# EAGLE design E300 (EAGLE 9.4.1)
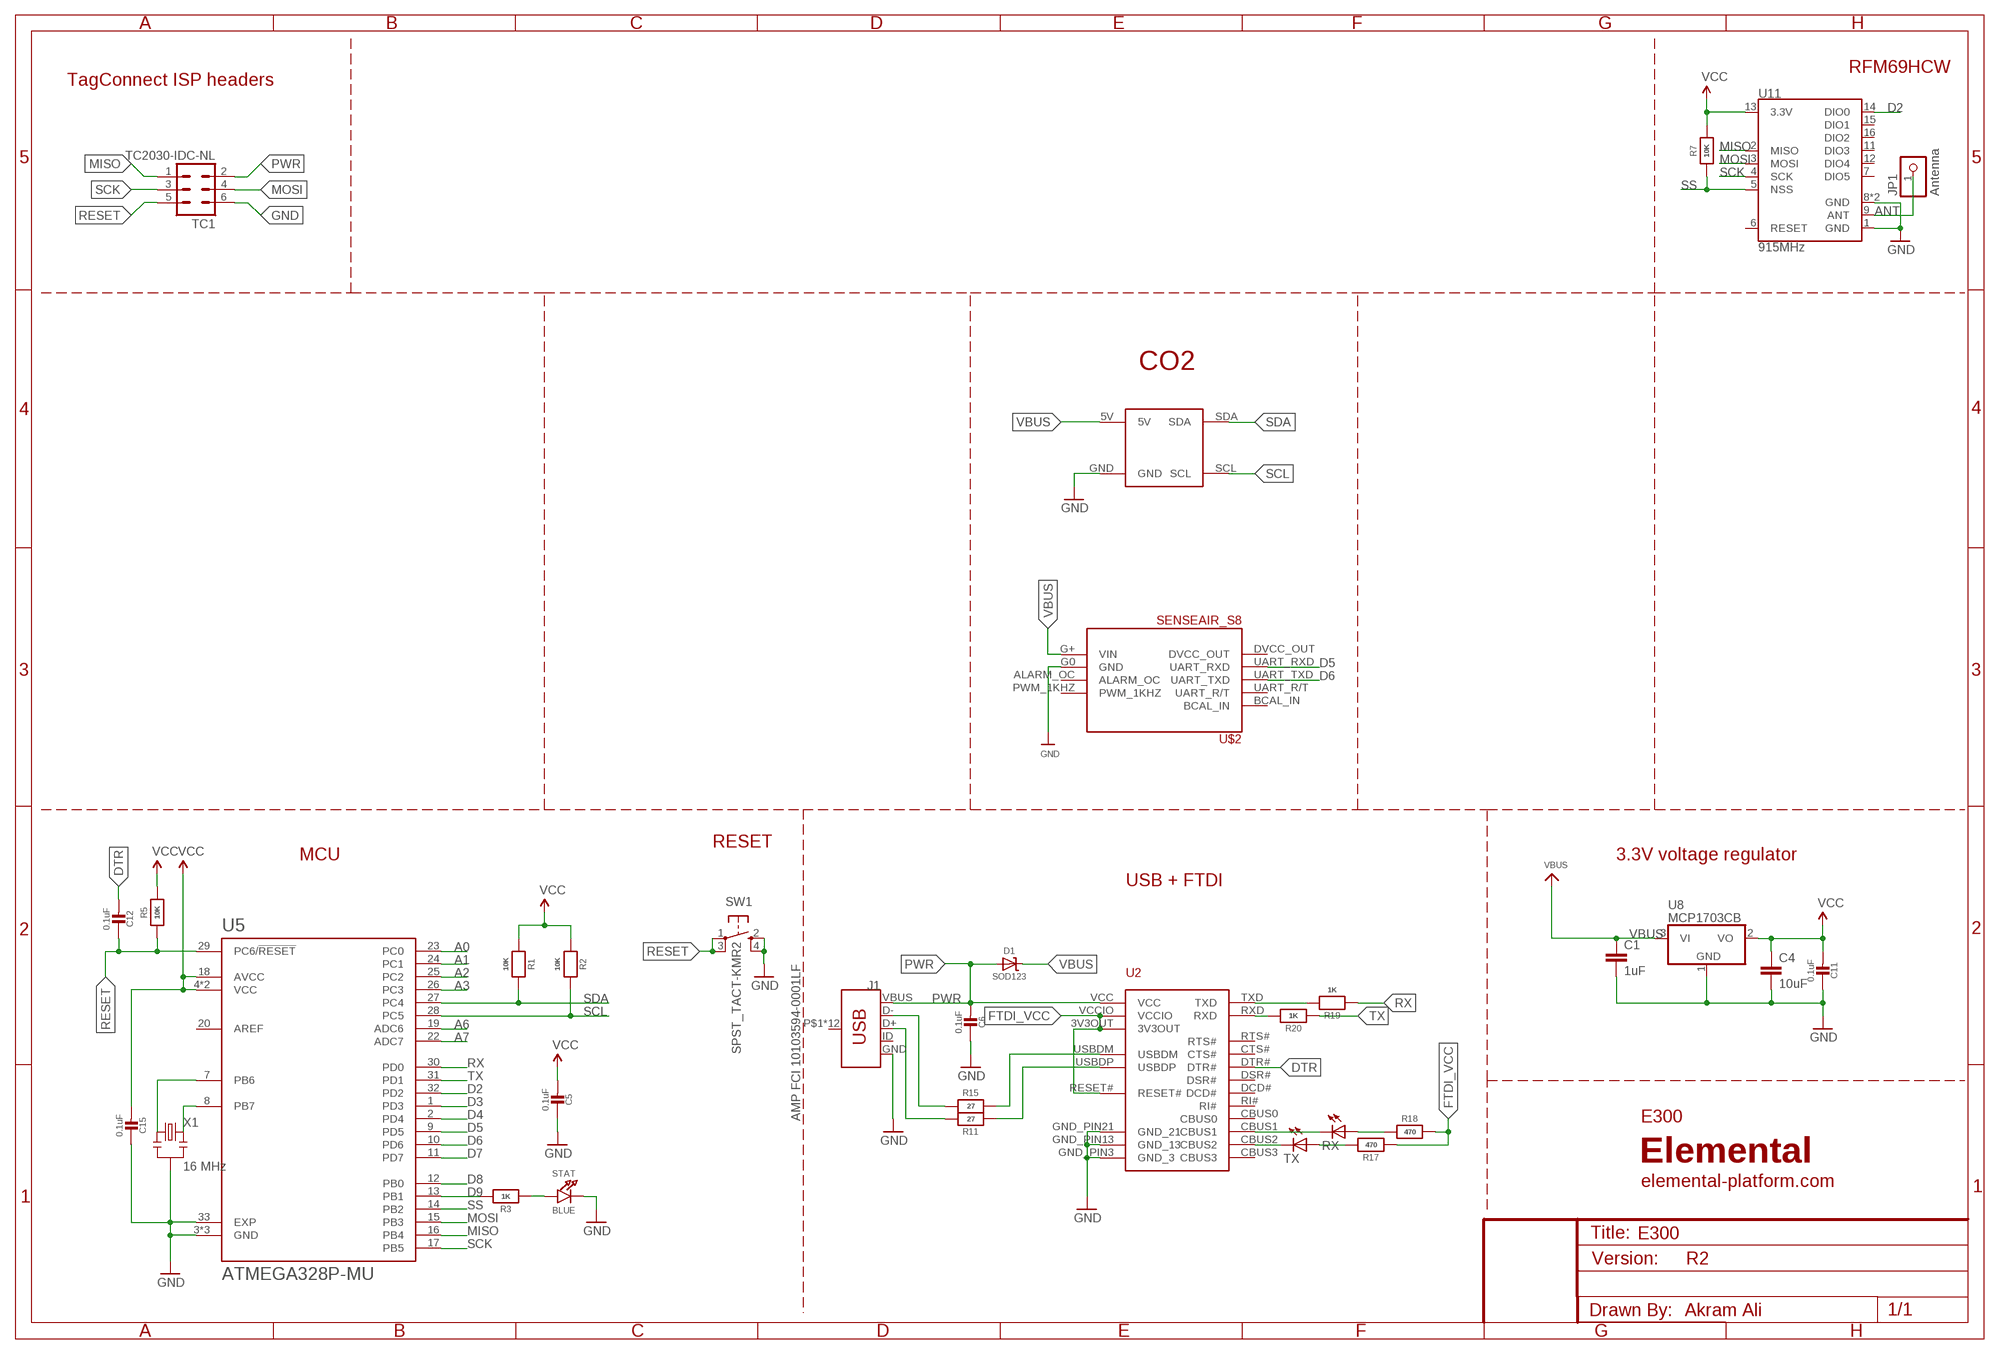
[diagram p0: schematic, sheet 1]

## Parts
C1  1uF  CAP0805  [0805]
C4  10uF  CAP0805  [0805]
C5  0.1uF  MICROBUILDER_CAP_CERAMIC_0402MP  [MICROBUILDER__0402MP]
C6  0.1uF  MICROBUILDER_CAP_CERAMIC_0402MP  [MICROBUILDER__0402MP]
C11  0.1uF  MICROBUILDER_CAP_CERAMIC_0402MP  [MICROBUILDER__0402MP]
C12  0.1uF  MICROBUILDER_CAP_CERAMIC_0402MP  [MICROBUILDER__0402MP]
C15  0.1uF  MICROBUILDER_CAP_CERAMIC_0402MP  [MICROBUILDER__0402MP]
D1  SOD123  MICROBUILDER_DIODE-SCHOTTKYSOD-123  [MICROBUILDER_SOD-123]
J1  AMP FCI 10103594-0001LF  USB_MICRO-B_HALF_PTH  [USB-MICROB-PTH]
JP1  Antenna  PINHD-1X1CB  [1X01-CLEANBIG]
R1  10K  MICROBUILDER_RESISTOR_0402MP  [MICROBUILDER__0402MP]
R2  10K  MICROBUILDER_RESISTOR_0402MP  [MICROBUILDER__0402MP]
R3  1K  MICROBUILDER_RESISTOR_0402MP  [MICROBUILDER__0402MP]
R5  10K  MICROBUILDER_RESISTOR_0402MP  [MICROBUILDER__0402MP]
R7  10K  MICROBUILDER_RESISTOR_0402MP  [MICROBUILDER__0402MP]
R11  27  MICROBUILDER_RESISTOR_0402MP  [MICROBUILDER__0402MP]
R15  27  MICROBUILDER_RESISTOR_0402MP  [MICROBUILDER__0402MP]
R17  470  MICROBUILDER_RESISTOR_0402MP  [MICROBUILDER__0402MP]
R18  470  MICROBUILDER_RESISTOR_0402MP  [MICROBUILDER__0402MP]
R19  1K  MICROBUILDER_RESISTOR_0402MP  [MICROBUILDER__0402MP]
R20  1K  MICROBUILDER_RESISTOR_0402MP  [MICROBUILDER__0402MP]
RX  LEDCHIPLED_0805  [CHIPLED_0805]
STAT  BLUE  LED0805_NOOUTLINE  [CHIPLED_0805_NOOUTLINE]
SW1  SPST_TACT-KMR2  [KMR2]
TC1  TC2030-IDC-NL  [TC2030-IDC-NL]
TX  LEDCHIPLED_0805  [CHIPLED_0805]
U2  FT231XQ-R  [FTDI_FT231XQ-R_PACKAGE]
U5  ATMEGA328P-MU  [QFN50P500X500X100-33N]
U6  K30-CO2-I2C  [K30-CO2-I2C]
U8  MCP1703CB  [SOT23]
U11  915MHz  RFM69HCW-915  [RFM69HCW-XXXS2]
U$2  SENSEAIR_S8  [SENSEAIR_S8]
X1  16 MHz  RESONATORSMD  [RESONATOR-SMD]

## Nets
A0: U5.23(PC0)
A1: U5.24(PC1)
A2: U5.25(PC2)
A3: U5.26(PC3)
A6: U5.19(ADC6)
A7: U5.22(ADC7)
ANT: JP1.1 U11.9(ANT)
D2: U5.32(PD2) U11.14(DIO0)
D3: U5.1(PD3)
D4: U5.2(PD4)
D5: U5.9(PD5) U$2.UART_RXD
D6: U5.10(PD6) U$2.UART_TXD
D7: U5.11(PD7)
D8: U5.12(PB0)
D9: R3.2 U5.13(PB1)
DTR: C12.2 U2.DTR#
FTDI_VCC: R17.1 R18.2 U2.3V3OUT U2.RESET# U2.VCCIO
GND: C1.2 C4.2 C5.1 C6.1 C11.1 C15.1 J1.GND STAT.C SW1.2(S) SW1.4(S1) TC1.6 U2.GND_PIN3(GND_3) U2.GND_PIN13(GND_13) U2.GND_PIN21(GND_21) U5.3(GND) U5.5(GND) U5.21(GND) U5.33(EXP) U6.GND U8.1(GND) U11.1(GND) U11.8(GND) U11.10(GND) U$2.G0(GND) X1.2
MISO: TC1.1 U5.16(PB4) U11.2(MISO)
MOSI: TC1.4 U5.15(PB3) U11.3(MOSI)
N$2: R20.2 U2.RXD
N$3: R19.2 U2.TXD
N$4: U5.8(PB7) X1.3
N$5: U5.7(PB6) X1.1
N$8: R3.1 STAT.A
N$17: RX.C U2.CBUS1
N$18: TX.C U2.CBUS2
N$25: R15.2 U2.USBDM
N$26: R11.1 U2.USBDP
N$27: R18.1 RX.A
N$29: R17.2 TX.A
N$32: J1.D- R15.1
N$33: J1.D+ R11.2
PWR: C6.2 D1.A J1.VBUS TC1.2 U2.VCC
RESET: C12.1 R5.1 SW1.1(P) SW1.3(P1) TC1.5 U5.29(PC6/!RESET)
RX: R19.1 U5.30(PD0)
SCK: TC1.3 U5.17(PB5) U11.4(SCK)
SCL: R2.2 U5.28(PC5) U6.SCL
SDA: R1.2 U5.27(PC4) U6.SDA
SS: R7.1 U5.14(PB2) U11.5(NSS)
TX: R20.1 U5.31(PD1)
VBUS: C1.1 D1.C U6.5V U8.3(VI) U$2.G+(VIN)
VCC: C4.1 C5.2 C11.2 C15.2 R1.1 R2.1 R5.2 R7.2 U5.4(VCC) U5.6(VCC) U5.18(AVCC) U8.2(VO) U11.13(3.3V)
Unconnected: J1.ID J1.P$1(SHIELD) J1.P$2(SHIELD) J1.P$3(SHIELD) J1.P$4(SHIELD) J1.P$6(SHIELD) J1.P$8(SHIELD) J1.P$10(SHIELD) J1.P$12(SHIELD) J1.SHEILD2(SHIELD) J1.SHIELD J1.SHIELD3(SHIELD) J1.SHIELD4(SHIELD) U2.CBUS0 U2.CBUS3 U2.CTS# U2.DCD# U2.DSR# U2.RI# U2.RTS# U5.20(AREF) U11.6(RESET) U11.7(DIO5) U11.11(DIO3) U11.12(DIO4) U11.15(DIO1) U11.16(DIO2) U$2.ALARM_OC U$2.BCAL_IN U$2.DVCC_OUT U$2.PWM_1KHZ U$2.UART_R/T

## Notes on the sheet
- RFM69HCW
- TagConnect ISP headers
- CO2
- RESET
- MCU | 3.3V voltage regulator
- USB + FTDI
- E300
- Elemental
- elemental-platform.com
- R2
- Akram Ali

## Library data of the parts
C1 = SparkFun-Capacitors:CAP: Capacitor Standard 0603 ceramic capacitor, and 0.1" leaded capacitor.; MPN: CC0805ZRY5V8BB105
C4 = SparkFun-Capacitors:CAP: Capacitor Standard 0603 ceramic capacitor, and 0.1" leaded capacitor.; MPN: CC0805KKX5R6BB106
C5 C6 C11 C12 C15 = Adafruit Feather 32u4 Bluefruit LE:MICROBUILDER_CAP_CERAMIC: Ceramic Capacitors For new designs, use the packages preceded by an '_' character since they are more reliable: The following footprints should be used on most boards: _0402 - Standard footprint for regular board layouts _0603 - Standard footprint for regular board layouts _0805 - Standard footprint for regular board layouts _1206 - Standard footprint for regular board layouts For extremely tight-pitch boards where space is at a premium, the following 'micro-pitch' footprints can be used (smaller pads, no silkscreen outline, etc.): _0402MP - Micro-pitch footprint for very dense/compact boards _0603MP - Micro-pitch footprint for very dense/compact boards _0805MP - Micro-pitch footprint for very dense/compact boards _1206MP - Micro-pitch footprint for very dense/compact boards; MPN: GRM155R71C104KA88J
D1 = Adafruit Feather 32u4 Bluefruit LE:MICROBUILDER_DIODE-SCHOTTKY; MPN: SD103AW-13-F
J1 = SparkFun-Connectors:USB_MICRO-B: USB Type Micro-B Connector Male/female and PTH/SMT variants SparkFun Products: SparkFun microB USB Breakout <https://www.sparkfun.com/products/12035> SparkFun USB microB Plug Breakout <https://www.sparkfun.com/products/10031> SparkFun ESP8266 Thing <https://www.sparkfun.com/products/13231>; PROD_ID: CONN-13711
JP1 = adafruit@1:PINHD-1X1: Pin header 1x1 for 0.1" spacing With round pins; MPN: Helical antenna
R1 R2 R19 R20 = Adafruit Feather 32u4 Bluefruit LE:MICROBUILDER_RESISTOR: Resistors For new designs, use the packages preceded by an '_' character since they are more reliable: The following footprints should be used on most boards: _0402 - Standard footprint for regular board layouts _0603 - Standard footprint for regular board layouts _0805 - Standard footprint for regular board layouts _1206 - Standard footprint for regular board layouts For extremely tight-pitch boards where space is at a premium, the following 'micro-pitch' footprints can be used (smaller pads, no silkscreen outline, etc.): _0402MP - Micro-pitch footprint for very dense/compact boards _0603MP - Micro-pitch footprint for very dense/compact boards _0805MP - Micro-pitch footprint for very dense/compact boards _1206MP - Micro-pitch footprint for very dense/compact boards; MPN: RC0402JR-071KL
R3 R5 R7 = Adafruit Feather 32u4 Bluefruit LE:MICROBUILDER_RESISTOR: Resistors For new designs, use the packages preceded by an '_' character since they are more reliable: The following footprints should be used on most boards: _0402 - Standard footprint for regular board layouts _0603 - Standard footprint for regular board layouts _0805 - Standard footprint for regular board layouts _1206 - Standard footprint for regular board layouts For extremely tight-pitch boards where space is at a premium, the following 'micro-pitch' footprints can be used (smaller pads, no silkscreen outline, etc.): _0402MP - Micro-pitch footprint for very dense/compact boards _0603MP - Micro-pitch footprint for very dense/compact boards _0805MP - Micro-pitch footprint for very dense/compact boards _1206MP - Micro-pitch footprint for very dense/compact boards; MPN: RC0402JR-0710KL
R11 R15 = Adafruit Feather 32u4 Bluefruit LE:MICROBUILDER_RESISTOR: Resistors For new designs, use the packages preceded by an '_' character since they are more reliable: The following footprints should be used on most boards: _0402 - Standard footprint for regular board layouts _0603 - Standard footprint for regular board layouts _0805 - Standard footprint for regular board layouts _1206 - Standard footprint for regular board layouts For extremely tight-pitch boards where space is at a premium, the following 'micro-pitch' footprints can be used (smaller pads, no silkscreen outline, etc.): _0402MP - Micro-pitch footprint for very dense/compact boards _0603MP - Micro-pitch footprint for very dense/compact boards _0805MP - Micro-pitch footprint for very dense/compact boards _1206MP - Micro-pitch footprint for very dense/compact boards; MPN: RC0402JR-0727RL
R17 R18 = Adafruit Feather 32u4 Bluefruit LE:MICROBUILDER_RESISTOR: Resistors For new designs, use the packages preceded by an '_' character since they are more reliable: The following footprints should be used on most boards: _0402 - Standard footprint for regular board layouts _0603 - Standard footprint for regular board layouts _0805 - Standard footprint for regular board layouts _1206 - Standard footprint for regular board layouts For extremely tight-pitch boards where space is at a premium, the following 'micro-pitch' footprints can be used (smaller pads, no silkscreen outline, etc.): _0402MP - Micro-pitch footprint for very dense/compact boards _0603MP - Micro-pitch footprint for very dense/compact boards _0805MP - Micro-pitch footprint for very dense/compact boards _1206MP - Micro-pitch footprint for very dense/compact boards; MPN: RC0402JR-07470RL
RX TX = adafruit:LED: LED; MPN: LG R971-KN-1; OC_NEWARK: unknown
STAT = microbuilder:LED: LED
SW1 = adafruit:SPST_TACT: SMT 6mm switch, EVQQ2 series http://www.ladyada.net/library/eagle
TC1 = TagConnect:TC2030-IDC: Tag-Connect In Circuit Programming & Debug Cable 6 Pin http://www.tag-connect.com
U2 = ftdi_ft231xq-r:FT231XQ-R: This is the 20-LD QFN package of the FTDI FT231XQ-R chip.; MPN: FT231XQ-R
U5 = ATMEGA328P-MU:ATMEGA328P-MU: ATmega Series 20 MHz 32 KB Flash 2 KB SRAM 8-Bit Microcontroller - QFN-32; AVAILABILITY: Good; DESCRIPTION: ATmega Series 20 MHz 32 KB Flash 2 KB SRAM 8-Bit Microcontroller - QFN-32; MF: Atmel; MP: ATMEGA328P-MU; MPN: ATMEGA328P-MU; PACKAGE: QFN-32 Atmel; PRICE: 2.55 USD
U6 = K30-CO2-I2C:K30-CO2-I2C: K-30 CO2 sensor I2C connection Designed by AKstudios
U8 = linear:MCP1703: 250 mA, 16V, Low Quiescent Current LDO Regulator Source: http://ww1.microchip.com/downloads/en/DeviceDoc/22049b.pdf; MPN: MCP1703T-3302E/CB; OC_NEWARK: 18T9177
U11 = SparkFun-RF:RFM69H: Hope RF RFM69H ISM Transceiver Module The RFM69H is a transceiver module capable of operation over a wide frequency range, including the 315,433,868 and 915MHz license-free ISM (Industry Scientific and Medical) frequency bands. All major RF communication parameters are programmable and most of them can be dynamically set. The RFM69H offers the unique advantage of programmable narrow-band and wide- band communication modes. The RFM69H is optimized for low power consumption while offering high RF output power and channelized operation.Compliance ETSI and FCC regulations. Datasheet <http://www.hoperf.cn/upload/docs/RF/SX/RFM69H_DataSheet_v1.3.pdf> SparkFun Products RFM69HCW Wireless Transceiver - 915MHz <https://www.sparkfun.com/products/13909> (COM-13909) RFM69HCW Wireless Transceiver - 434MHz <https://www.sparkfun.com/products/13910> (COM-13910) SparkFun RFM69 Breakout (915MHz) <https://www.sparkfun.com/products/12775> (WRL-12775) SparkFun RFM69 Breakout (434MHz) <https://www.sparkfun.com/products/12823> (WRL-12823); MPN: RFM69HCW; PROD_ID: IC-11997
U$2 = SenseAir S8:SENSEAIR_S8: MH-z19 Footprint EAGLE footprint of MH-z19 CO2 sensor. Designed by AKstudios github.com/akstudios
X1 = SparkFun:RESONATOR: Resonator Small SMD resonator. This is the itty bitty 10/20MHz resonators with built in caps. CSTCE10M0G55 and CSTCE20M0V53. Footprint has been reviewed closely but hasn't been tested yet.; MPN: CSTCE16M0V53-R0

## Net classes
1 power: width 0.381 mm, clearance 0.254 mm

## Board
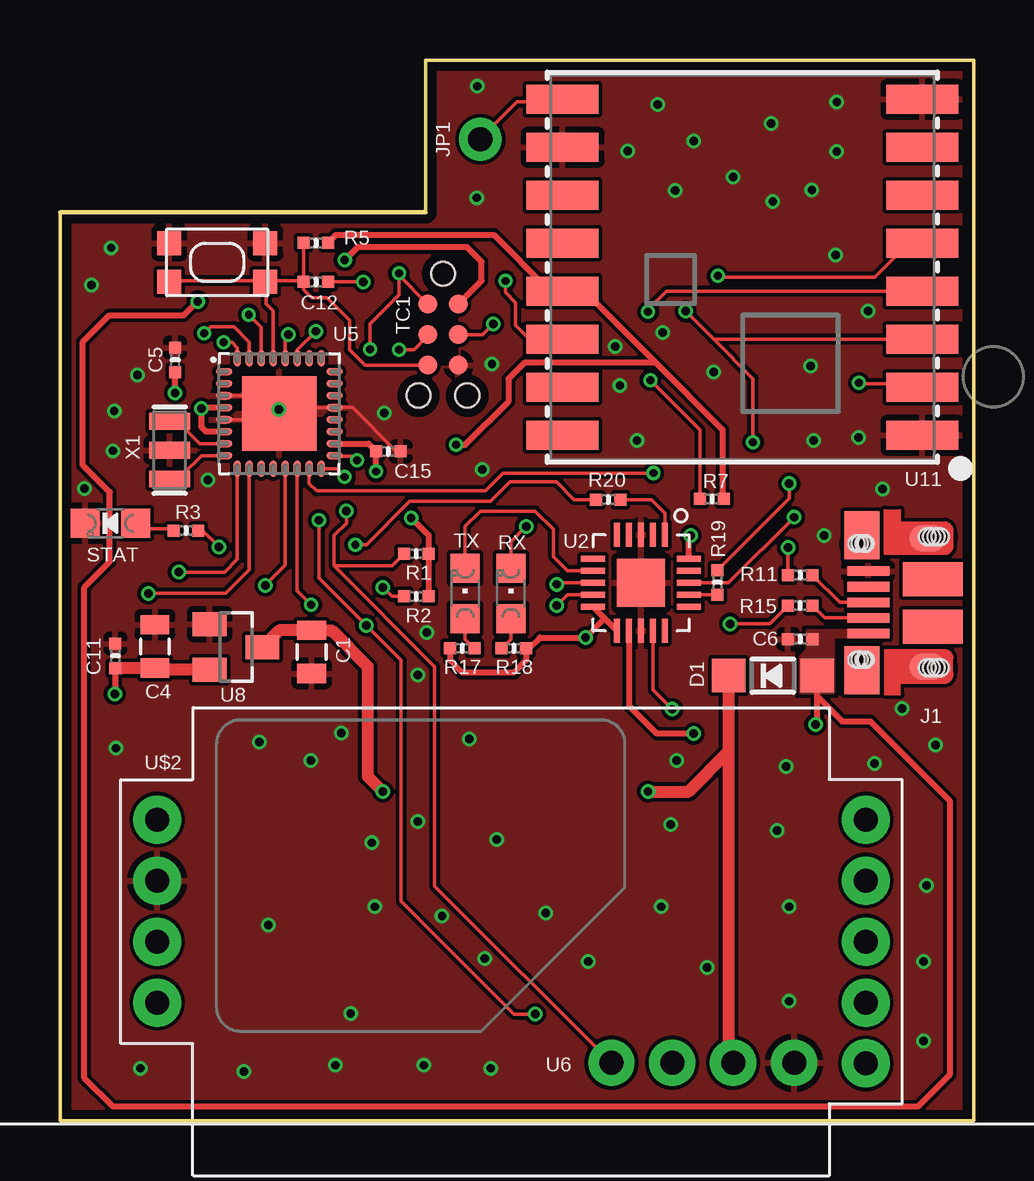
[diagram p1: board, top side]
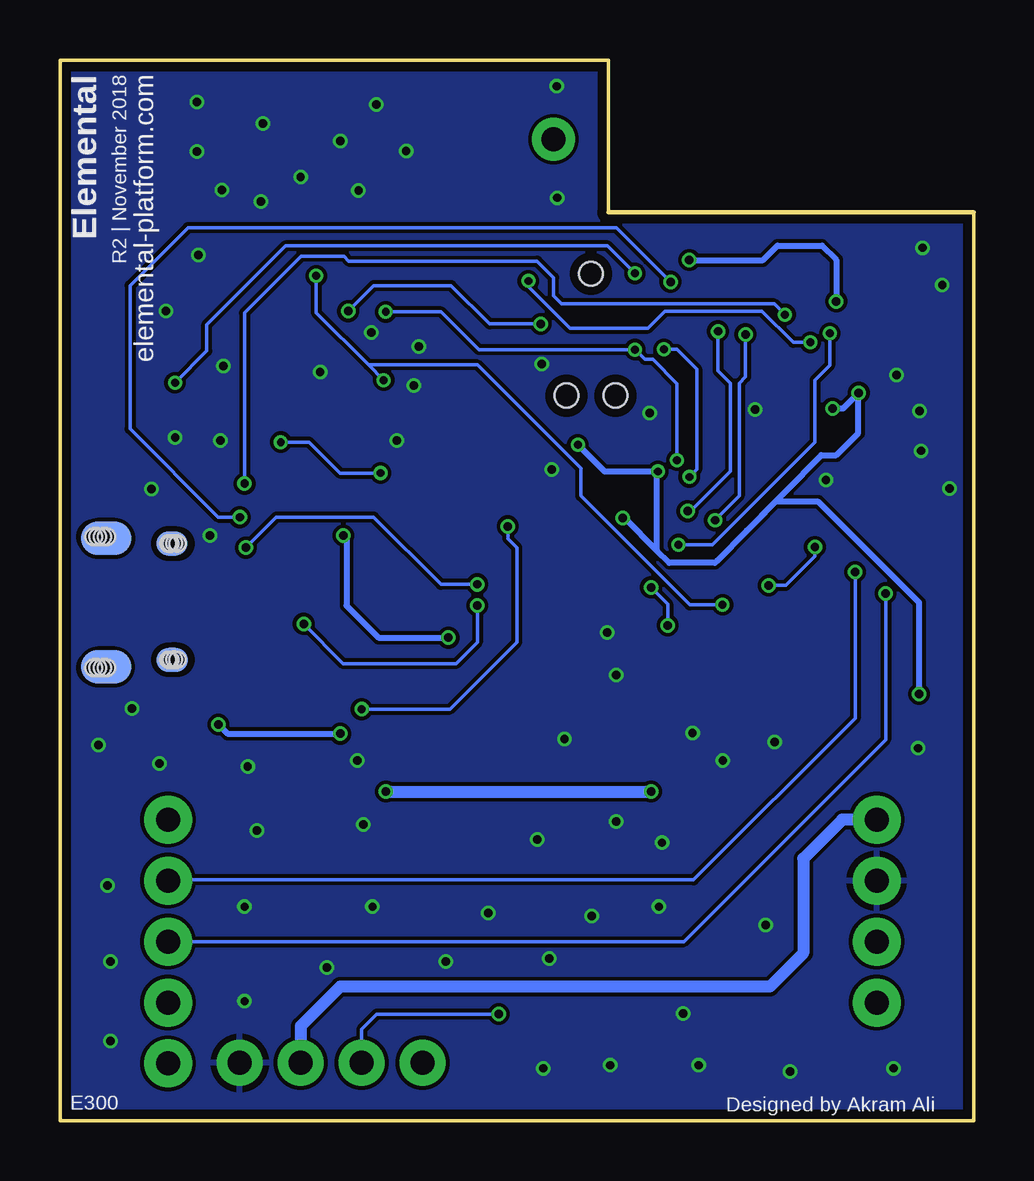
[diagram p2: board, bottom side, seen from below]

Size 38.1 x 44.2 mm. Coordinates in mm from the lower left corner, seen from the top.
Outline: 0,37.85 15.24,37.85 15.24,44.2 38.1,44.2 38.1,0 0,0 0,37.85
Copper layers (1*16): Top 0.035559375mm / dielectric 1.6mm / Bottom 0.035559375mm
Design rules "oshpark-2layer": minimum track width 6mil, minimum drill 10mil, track to track 6mil, track to pad 6mil, pad to pad 6mil, via to via 6mil, smd to smd 6mil, copper to edge 15mil, drill to drill 6mil, minimum pad ring 5mil, minimum via ring 5mil, stop-mask expansion 2.5mil, vias tented up to drill 0mil, thermal gap 10mil

### Footprints (pad centres in the part's own frame; a part is rotated, then mirrored left to right if it is on the bottom)
0805 = smd 0.8 x 1.2: 1 -0.9,0; 2 0.9,0
MICROBUILDER__0402MP = smd 0.5 x 0.5: 1 -0.508,0; 2 0.508,0
MICROBUILDER_SOD-123 = smd 1.4 x 1.4: A 1.85,0; C -1.85,0
USB-MICROB-PTH = smd 0.4 x 1.75: D+ 0.031,1.331; D- -0.619,1.331; GND 1.331,1.331; ID 0.681,1.331; VBUS -1.269,1.331 | smd 1.4 x 2.1 bottom: P$1 2.701,-1.142; P$3 -2.659,-1.144 | smd 1 x 1.3: P$2 2.487,1.594; P$6 -2.368,1.604 | smd 1 x 1.3 bottom: P$4 -2.368,1.604; P$10 2.481,1.598 | smd 1.1 x 1.5: P$8 2.701,-1.142; P$12 -2.659,-1.144 | smd 2 x 1.46: SHEILD2 2.831,1.606; SHIELD -2.794,1.606 | smd 1.425 x 2.5: SHIELD3 -0.979,-1.349; SHIELD4 0.996,-1.352 | hole 0.7: -2.693,-1.134; -2.693,-1.3; -2.694,-1.499; -2.694,-1.664; 2.768,-1.134; 2.767,-1.303; 2.766,-1.496; 2.766,-1.664 | hole 0.66: -2.359,1.821; -2.349,1.691; -2.359,1.541; -2.354,1.432; 2.481,1.821; 2.491,1.691; 2.481,1.541; 2.486,1.432
1X01-CLEANBIG = drill 1.016 pad 1.778: 1 0,0
CHIPLED_0805 = smd 1.2 x 1.2: A 0,-1.05; C 0,1.05
CHIPLED_0805_NOOUTLINE = smd 1.2 x 1.2: A 0,-1.05; C 0,1.05
KMR2 = smd 1 x 1: 1 2,0.8; 2 2,-0.8; 3 -2,0.8; 4 -2,-0.8
TC2030-IDC-NL = smd 0.787 x 0.787: 1 -1.27,-0.635; 2 -1.27,0.635; 3 0,-0.635; 4 0,0.635; 5 1.27,-0.635; 6 1.27,0.635 | hole 0.991: -2.54,0; 2.54,1.016; 2.54,-1.016
FTDI_FT231XQ-R_PACKAGE = smd 0.25 x 1: 3V3OUT 0.968,-2.032; CBUS2 -0.532,-2.032; CBUS3 0.968,1.968; CTS# -1.032,-2.032; DTR# -0.032,1.968; RTS# -0.532,1.968; TXD 0.468,1.968; USBDM 0.468,-2.032; USBDP -0.032,-2.032; VCCIO -1.032,1.968 | smd 1 x 0.25: CBUS0 1.968,0.968; CBUS1 1.968,0.468; DCD# -2.032,-1.032; DSR# -2.032,-0.532; GND_PIN3 -2.032,-0.032; GND_PIN13 1.968,-0.032; RESET# 1.968,-1.032; RI# -2.032,0.468; RXD -2.032,0.968; VCC 1.968,-0.532 | smd 2 x 2: GND_PIN21 -0.032,-0.032
QFN50P500X500X100-33N = smd 0.7 x 0.3: 1 -2.3,1.75; 2 -2.3,1.25; 3 -2.3,0.75; 4 -2.3,0.25; 5 -2.3,-0.25; 6 -2.3,-0.75; 7 -2.3,-1.25; 8 -2.3,-1.75; 17 2.3,-1.75; 18 2.3,-1.25; 19 2.3,-0.75; 20 2.3,-0.25; 21 2.3,0.25; 22 2.3,0.75; 23 2.3,1.25; 24 2.3,1.75 | smd 0.3 x 0.7: 9 -1.75,-2.3; 10 -1.25,-2.3; 11 -0.75,-2.3; 12 -0.25,-2.3; 13 0.25,-2.3; 14 0.75,-2.3; 15 1.25,-2.3; 16 1.75,-2.3; 25 1.75,2.3; 26 1.25,2.3; 27 0.75,2.3; 28 0.25,2.3; 29 -0.25,2.3; 30 -0.75,2.3; 31 -1.25,2.3; 32 -1.75,2.3 | smd 3.1 x 3.1: 33 0,0
K30-CO2-I2C = drill 1 pad 1.93: 5V 43.18,2.54; GND 45.72,2.54; SCL 40.64,2.54; SDA 38.1,2.54
SOT23 = smd 1 x 1.4: 1 -0.95,-1.1; 2 0.95,-1.1; 3 0,1.1
RFM69HCW-XXXS2 = smd 3 x 1.2: 1 -7.5,7; 2 -7.5,5; 3 -7.5,3; 4 -7.5,1; 5 -7.5,-1; 6 -7.5,-3; 7 -7.5,-5; 8 -7.5,-7; 9 7.5,-7; 10 7.5,-5; 11 7.5,-3; 12 7.5,-1; 13 7.5,1; 14 7.5,3; 15 7.5,5; 16 7.5,7
SENSEAIR_S8 = drill 1 pad 2: ALARM_OC 1.515,9.75; BCAL_IN 31.055,4.67; DVCC_OUT 31.055,14.83; G0 1.515,12.29; G+ 1.515,14.83; PWM_1KHZ 1.515,7.21; UART_R/T 31.055,7.21; UART_RXD 31.055,12.29; UART_TXD 31.055,9.75
RESONATOR-SMD = smd 0.7 x 1.7: 1 -1.2,0; 2 0,0; 3 1.2,0

### Placement (x,y rotation side)
C1  10.49,19.53 270 top
C4  3.96,19.76 90 top
C5  4.8,31.7 270 top
C6  30.86,20.07 0 top
C11  2.31,19.37 270 top
C12  10.67,34.95 0 top
C15  13.69,27.89 180 top
D1  29.72,18.54 0 top
J1  35.03,21.56 90 top
JP1  17.53,40.89 0 top
R1  14.86,23.62 180 top
R2  14.86,21.84 180 top
R3  5.26,24.59 0 top
R5  10.67,36.58 0 top
R7  27.18,25.91 0 top
R11  30.86,22.73 0 top
R15  30.86,21.46 180 top
R17  16.76,19.69 0 top
R18  18.92,19.69 0 top
R19  27.41,22.43 270 top
R20  22.86,25.88 0 top
RX  18.8,21.97 0 top
STAT  2.11,24.89 90 top
SW1  6.55,35.76 180 top
TC1  15.96,32.75 270 top
TX  16.89,21.97 0 top
U2  24.26,22.38 270 top
U5  9.14,29.46 0 top
U6  -15.11,-0.13 0 top
U8  7.34,19.74 270 top
U11  28.45,35.56 180 top
U$2  2.54,-2.29 0 top
X1  4.57,27.94 270 top

### Tracks (layer width: path | path; a pad name or v marks a point on that pad's centre or on a via)
ANT
  Top 0.152: U11.9 20.8,42.45 19.05,42.45 17.62,41.02 JP1.1
D2  (via drill 0.33)
  Top 0.152: v18.57,34.99 18.57,34.51 19,34.09 19,33.15 19.54,32.61 20.8,32.61 U11.14 | U5.32 7.39,32.21 7.17,32.43 v6.82,32.43
  Bottom 0.152: v18.57,34.99 18.57,34.75 16.84,33.02 13.59,33.02 12.88,33.73 8.84,33.73 7.54,32.43 v6.82,32.43
D5  (via drill 0.35)
  Top 0.152: v4.95,22.86 6.86,22.86 7.39,23.4 U5.9
  Bottom 0.152: v4.95,22.86 4.95,16.76 11.68,10.03 33.57,10.03 U$2.UART_RXD
D6  (via drill 0.35)
  Top 0.152: U5.10 7.89,22.96 6.91,21.97 v3.68,21.97
  Bottom 0.152: U$2.UART_TXD 12.09,7.46 3.68,15.88 v3.68,21.97
D9  (via drill 0.35)
  Top 0.152: R3.2 5.87,24.67 v6.63,23.91 v6.63,23.9 | v8.56,22.3 9.39,23.14 U5.13
  Bottom 0.152: v8.56,22.3 7.85,22.3 6.63,23.52 v6.63,23.9
DTR  (via drill 0.35)
  Top 0.152: v12.65,34.95 C12.2 | U2.DTR# 27.87,22.41 v30.61,25.15
  Bottom 0.152: v12.65,34.95 14.91,37.21 32.77,37.21 35.18,34.8 35.18,28.83 31.5,25.15 v30.61,25.15
FTDI_VCC  (via drill 0.35)
  Top 0.254: R17.1 16.26,19.18 16.76,18.67 18.92,18.67 19.43,19.18 R18.2 19.56,19.69 20,20.13 v21.91,20.13 22.71,20.93 | U2.3V3OUT 22.71,20.93 | 22.71,20.93 U2.RESET# | U2.VCCIO 26.23,24.32 v26.29,24.38
  Bottom 0.254: v26.29,24.38 26.16,24.26 26.16,21.46 24.83,20.13 v21.91,20.13
GND  (via drill 0.35)
  Top 0.152: U5.5 8.69,29.21 v9.12,29.64 8.55,30.21 U5.3 | C15.1 14.02,27.89 12.19,29.72 U5.21 9.39,29.71 U5.33
  other vias: 2.21,27.91 18.01,31.52 24.92,42.34 26.42,40.82 31.34,38.79 28.07,39.32 17.4,43.1 17.37,38.46 34.29,26.31 33.3,28.47 31.85,24.38 6.17,26.7 2.13,36.37 2.26,29.57 1.02,26.34 17.6,27.13 23.34,30.63 27.25,31.19 33.68,33.73 32.33,36.07 25.65,38.76 32.38,42.44 23.67,40.41 3.23,31.06 32.38,40.39 31.29,31.45 23.14,32.26 25.12,32.84 25.45,12.34 8.69,8.15 26.97,6.38 30.4,4.98 25.07,8.92 13.13,8.92 13,11.58 10.46,15.01 8.31,15.77 2.34,15.52 3.35,2.18 7.67,2.06 12.12,4.47 15.16,2.31 17.96,2.18 30.4,8.92 29.9,12.09 30.28,14.76 33.96,14.88 35.1,17.17 36.5,15.65 35.99,3.33 35.99,6.63 36.12,9.8 17.07,15.9 15.29,20.35 13.51,29.49 24.05,28.35 31.42,28.35 29.64,41.55 1.32,34.82 18.21,11.71 20.24,8.66 22.02,6.63 14.91,12.47 15.93,8.53 17.7,6.76 14.91,18.57 11.73,16.15 25.7,15.01 11.48,2.31 29.72,38.3
  pour Top (rank 6): 39.37,45.47 39.37,-0.25 -1.27,-0.25 -1.27,45.47
  pour Bottom: -1.52,45.72 39.62,45.72 39.62,-0.51 -1.52,-0.51
MISO  (via drill 0.33)
  Top 0.152: U11.2 35.88,30.7 33.35,30.7 v33.31,30.75 | U5.16 11.53,27.16 v11.87,26.82 | v12.92,32.14 12.92,33.21 14.13,34.42 v14.13,35.31 14.13,35.22 TC1.1
  Bottom 0.152: v33.31,30.75 31.98,32.07 31.98,33.17 28.7,36.45 15.27,36.45 v14.13,35.31 | v11.87,26.82 11.56,27.13 11.56,31.32 12.38,32.14 v12.92,32.14
MOSI  (via drill 0.33, 0.35)
  Top 0.152: v24.73,26.99 24.72,26.98 18.47,26.98 17.73,26.24 10.69,26.24 10.39,26.54 U5.15 | v18.06,33.2 17.61,32.75 TC1.4 | v26.09,33.73 27.26,32.56 | U11.3 27.26,32.56 | v28.89,28.28 28.89,30.92 27.26,32.56
  Bottom 0.152: v18.06,33.2 20.19,33.2 21.79,34.8 25.02,34.8 v26.09,33.73 | v28.89,28.28 27.72,28.28 26.43,26.99 v24.73,26.99
N$2
  Top 0.152: U2.RXD 25.23,25.32 24.66,25.88 R20.2
N$3
  Top 0.152: U2.TXD 27.4,21.91 R19.2
N$4
  Top 0.152: X1.3 4.6,26.89 5.08,26.89 5.9,27.71 U5.8
N$5
  Top 0.152: X1.1 4.6,29.12 4.92,29.12 5.82,28.21 U5.7
N$8
  Top 0.152: R3.1 4.6,24.67 3.33,24.67 3.17,24.83 STAT.A
N$17  (via drill 0.35)
  Top 0.152: RX.C 18.8,24.13 v19.43,24.77 | U2.CBUS1 24.73,17.95 v25.53,17.15
  Bottom 0.152: v25.53,17.15 21.84,17.15 19.05,19.94 19.05,23.88 19.43,24.26 v19.43,24.77
N$18
  Top 0.152: U2.CBUS2 21.16,22.91 20.57,23.5 20.57,24.64 19.81,25.4 17.53,25.4 16.89,24.77 TX.C
N$25  (via drill 0.35)
  Top 0.152: U2.USBDM 21.15,21.91 v20.7,21.46 | R15.2 29.59,20.7 v27.94,20.7
  Bottom 0.152: v20.7,21.46 20.7,19.94 21.59,19.05 26.29,19.05 v27.94,20.7
N$26  (via drill 0.35)
  Top 0.152: U2.USBDP 20.76,22.41 v20.7,22.35 | v30.35,23.88 R11.1
  Bottom 0.152: v20.7,22.35 22.23,22.35 25.02,25.15 29.08,25.15 v30.35,23.88
N$27
  Top 0.152: R18.1 18.8,20.07 RX.A
N$29
  Top 0.152: R17.2 16.89,20.07 TX.A
N$32
  Top 0.152: J1.D- 31.89,20.95 R15.1
N$33
  Top 0.152: J1.D+ 32.51,21.6 R11.2
PWR  (via drill 0.35)
  Top 0.254: v11.87,35.86 12.4,36.4 16.97,36.4 17.58,35.79 17.58,35 TC1.2 | v5.74,34.14 5.16,33.55 2.06,33.55 0.95,32.45 0.95,27.32 2.08,26.19 2.08,23.29 1.02,22.23 1.02,1.78 2.21,0.58 35.76,0.58 37.08,1.91 37.08,13.34 33.78,16.64 32.61,16.64 31.57,17.68 | 31.57,17.68 D1.A | U2.VCC 23.73,17.3 24.89,16.13 v26.42,16.13 | v31.5,16.51 31.57,16.58 31.57,17.68
  Bottom 0.254: v11.87,35.86 8.79,35.86 8.19,36.46 6.34,36.46 5.74,35.87 v5.74,34.14 | v26.42,16.13 31.11,16.13 v31.5,16.51
  pour Top (no thermals): 34.49,20.42 34.49,20.17 32.23,20.17 32.23,17.83 30.86,17.83 30.86,19.33 31.17,19.63 31.17,20.42
RESET
  Top 0.152: 8.89,34.99 8.57,34.99 SW1.3 | 8.89,34.99 10.16,34.99 | 10.16,34.99 R5.1 | 10.16,34.99 C12.1 10.16,34.62 10.49,34.29 11.12,34.29 12.06,33.35 12.06,32.13 12.71,31.48 TC1.5 | 8.89,34.99 SW1.3 | SW1.1 4.6,34.99 8.41,34.99 SW1.3 | U5.29 8.89,33.75 8.6,34.05 8.6,34.92 SW1.3
RX  (via drill 0.33, 0.35)
  Top 0.152: U5.30 8.39,33.07 v7.87,33.59 | R19.1 30.4,25.93 v30.4,26.54
  Bottom 0.152: v30.4,26.54 30.4,33.66 28.04,36.02 26.26,36.02 26.06,35.81 18.21,35.81 17.53,35.13 17.53,34.37 17.19,34.04 8.32,34.04 v7.87,33.59
SCK  (via drill 0.33)
  Top 0.152: v12.38,27.53 12.22,27.69 11.59,27.69 U5.17 | v14.13,32.13 14.76,32.13 15.33,32.7 TC1.3 | U11.4 25.28,34.56 24.52,33.8 v24.52,33.7
  Bottom 0.152: v24.52,33.7 22.21,33.7 20.64,32.13 v14.13,32.13 13.72,31.72 13.39,31.72 12.38,30.72 v12.38,27.53
SCL  (via drill 0.35)
  Top 0.152: U5.28 9.39,32.63 v9.53,32.77 | v10.79,25.02 10.79,22.61 v12.76,20.64 14.22,19.18 14.22,9.14 18.92,4.45 v19.81,4.45 | R2.2 13.84,21.84 v13.46,22.23
  Bottom 0.152: v9.53,32.77 9.53,30.99 9.78,30.73 9.78,26.04 v10.79,25.02 | v19.81,4.45 24.89,4.45 25.53,3.81 U6.SCL | v13.46,22.23 12.76,21.53 v12.76,20.64
SDA  (via drill 0.35)
  Top 0.152: U5.27 9.89,32.12 v10.67,32.89 | v11.94,25.4 11.94,24.89 11.43,24.38 11.43,23.11 | U6.SDA 15.62,9.78 15.62,18.92 11.43,23.11 | R1.2 13.84,23.11 11.43,23.11
  Bottom 0.152: v10.67,32.89 10.67,31.24 10.16,30.73 10.16,27.05 11.81,25.4 v11.94,25.4
SS  (via drill 0.33)
  Top 0.152: R7.1 26.67,28.8 v24.61,30.86 | U11.5 35.88,36.42 35.24,36.42 33.97,35.15 27.47,35.15 v27.42,35.2 | U5.14 9.89,22.08 v10.48,21.5
  Bottom 0.152: v27.42,35.2 27.42,33.67 25.24,31.5 | 25.24,31.5 v24.61,30.86 | v10.48,21.5 11.84,21.5 16.38,26.04 16.38,27.18 20.7,31.5 25.24,31.5
TX  (via drill 0.33)
  Top 0.152: U5.31 7.89,32.44 7.25,33.08 6.28,33.08 v6.01,32.81 | v12.31,24 12.78,24 14.58,25.81 17.96,25.81 18.77,26.62 20.69,26.62 21.43,25.88 R20.1
  Bottom 0.152: v6.01,32.81 6.01,31.47 6.62,30.86 6.62,28.28 10.9,24 v12.31,24
VBUS  (via drill 0.35)
  Top 0.508: v24.51,13.72 26.22,13.72 27.87,15.37 | v13.46,13.72 12.83,14.35 12.83,18.92 11.32,20.43 C1.1 9.14,20.43 U8.3 | D1.C 27.87,15.37 | 27.87,15.37 27.87,12.7 27.87,12.52 27.87,2.61 U6.5V
  Bottom 0.508: v24.51,13.72 v13.46,13.72 | U$2.G+ 5.49,12.54 7.11,10.92 7.11,6.98 8.51,5.59 26.42,5.59 28.07,3.94 U6.5V
VCC  (via drill 0.33, 0.35)
  Top 0.152: 20.32,34.67 20.8,34.67 U11.13 20.95,34.51 | v13.18,27.05 v13.18,27.06 | 5.89,28.91 5.9,28.91
  Top 0.254: 20.32,34.67 18.09,36.91 11.51,36.91 R5.2 | 24.85,31.57 21.91,34.51 20.95,34.51 | 24.85,31.57 27.62,28.8 27.62,25.91 R7.2 | v13.18,27.06 C15.2 12.86,28.21 U5.18 | v4.8,30.33 C5.2 | U5.6 6.08,28.71 5.89,28.91 | 5.9,28.91 v5.9,29.67 5.94,29.71 U5.4 | v16.51,28.16 16.89,28.16 18.69,29.97 18.69,30.91 19.36,31.57 24.85,31.57 | C11.2 2.31,17.8 v2.29,17.78 | R2.1 R1.1 15.37,24.38 v14.64,25.11
  Top 0.305: 4.04,18.79 C4.1
  Top 0.508: U8.2 4.04,18.79 | C4.1 C11.2
  Bottom 0.152: 4.83,30.3 v4.8,30.33
  Bottom 0.254: 9.47,24.58 10.7,23.34 10.8,23.24 12.7,23.24 13.21,23.75 | 9.47,24.58 6.36,27.74 5.74,27.74 4.83,28.65 4.83,30.3 | v16.51,28.16 15.4,27.05 v13.18,27.05 13.21,27.02 13.21,23.75 | v4.8,30.33 5.46,29.67 v5.9,29.67 | v2.29,17.78 2.29,21.59 6.48,25.78 8.28,25.78 9.47,24.58 | 13.21,23.75 14.57,25.11 v14.64,25.11

### Text on the board
_bsilk: elemental-platform.com | R2 | November 2018 | Elemental | E300 | Designed by Akram Ali